# Altium project FMC_POF.PrjPcb
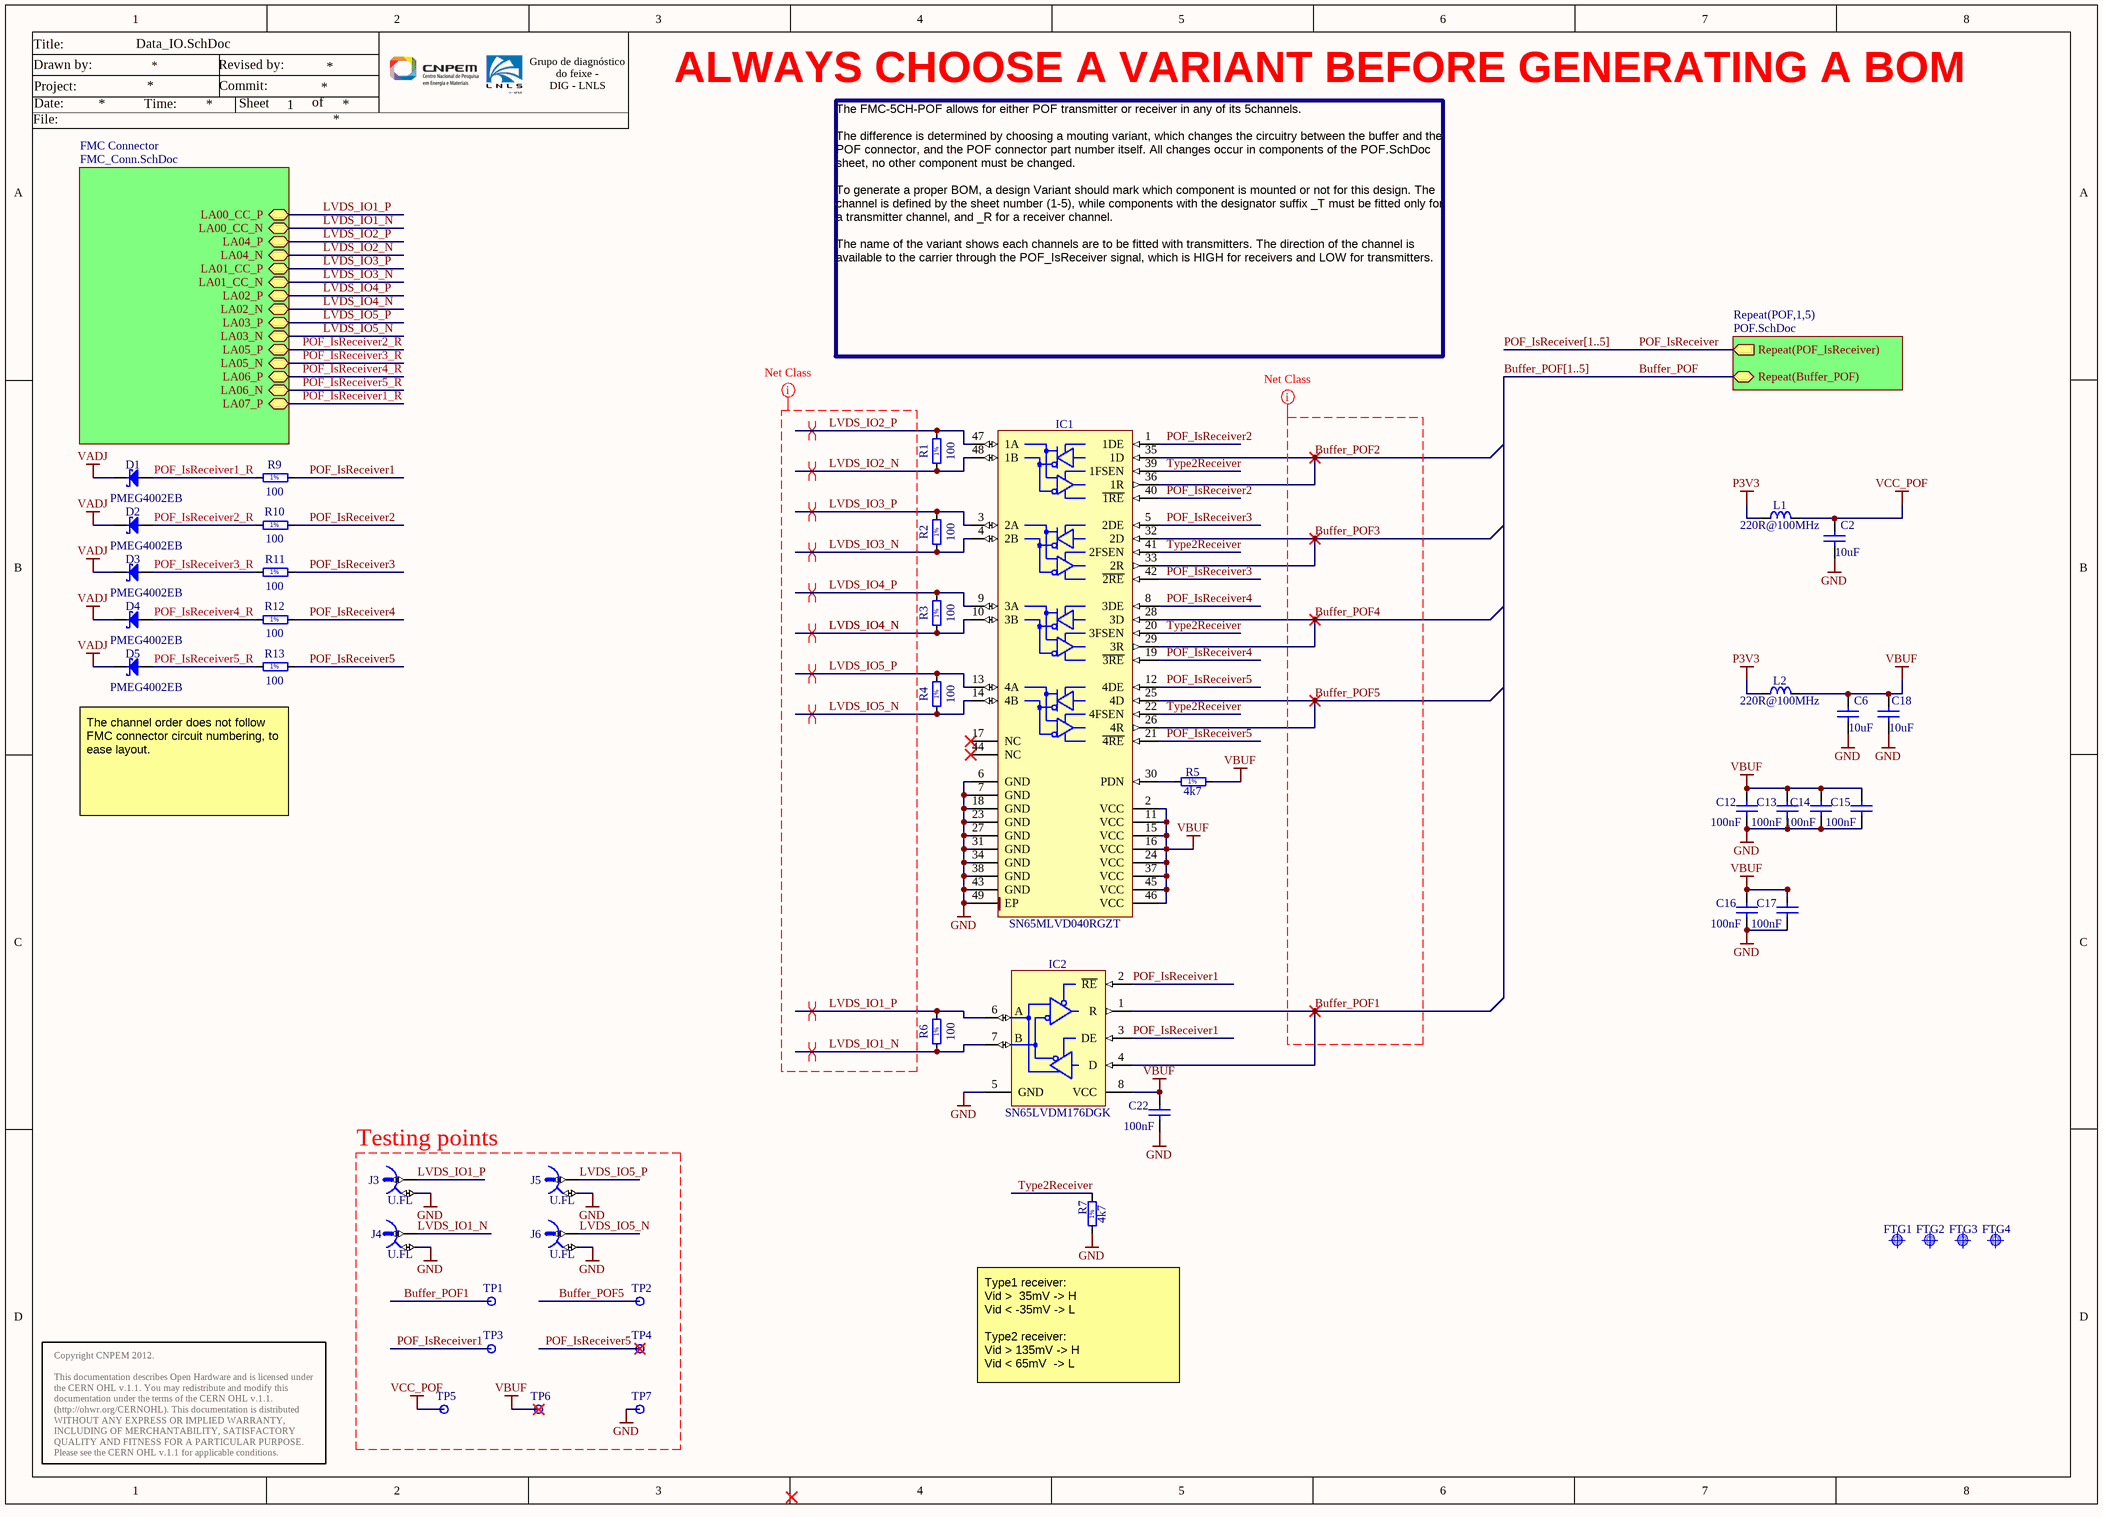
[diagram p0: Data_IO.SchDoc]
3 sheets, 115 parts. Net scope: hierarchical (ports join the sheet entries above them; power ports are global).
Board file: fmc-5pof.PcbDoc
Sheets:
  Data_IO.SchDoc
    POF1 = POF.SchDoc
    POF2 = POF.SchDoc
    POF3 = POF.SchDoc
    POF4 = POF.SchDoc
    POF5 = POF.SchDoc
    FMC Connector = FMC_Conn.SchDoc

## Sheet Data_IO.SchDoc
size A3; SheetNumber: 1

### Parts
C2  10uF  [CAPC2012X135N]
C6  10uF  [CAPC2012X135N]
C12  100nF  [CAPC1005X55N]
C13  100nF  [CAPC1005X55N]
C14  100nF  [CAPC1005X55N]
C15  100nF  [CAPC1005X55N]
C16  100nF  [CAPC1005X55N]
C17  100nF  [CAPC1005X55N]
C18  10uF  [CAPC2012X135N]
C22  100nF  [CAPC1005X55N]
D1  PMEG4002EB  [SODFL1608X65N]
D2  PMEG4002EB  [SODFL1608X65N]
D3  PMEG4002EB  [SODFL1608X65N]
D4  PMEG4002EB  [SODFL1608X65N]
D5  PMEG4002EB  [SODFL1608X65N]
FTG1  Use only in PCB  [FIDUCIAL_TOP_S100-200]  (value not drawn)
FTG2  Use only in PCB  [FIDUCIAL_TOP_S100-200]  (value not drawn)
FTG3  Use only in PCB  [FIDUCIAL_TOP_S100-200]  (value not drawn)
FTG4  Use only in PCB  [FIDUCIAL_TOP_S100-200]  (value not drawn)
IC1  SN65MLVD040RGZT  [QFN50P700X700X100-49N-S420]
IC2  SN65LVDM176DGK  [SOP65P490X110-8N]
J3  U.FL  [HIROSE_U.FL-R-SMT-1(10)]
J4  U.FL  [HIROSE_U.FL-R-SMT-1(10)]
J5  U.FL  [HIROSE_U.FL-R-SMT-1(10)]
J6  U.FL  [HIROSE_U.FL-R-SMT-1(10)]
L1  220R@100MHz  [INDC2012X105N]
L2  220R@100MHz  [INDC2012X105N]
R1  100  [RESC1005X40N]
R2  100  [RESC1005X40N]
R3  100  [RESC1005X40N]
R4  100  [RESC1005X40N]
R5  4k7  [RESC1005X40N]
R6  100  [RESC1005X40N]
R7  4k7  [RESC1005X40N]
R9  100  [RESC1005X40N]
R10  100  [RESC1005X40N]
R11  100  [RESC1005X40N]
R12  100  [RESC1005X40N]
R13  100  [RESC1005X40N]
TP1  Plated Hole  [c300h160]  (value not drawn)
TP2  Plated Hole  [c300h160]  (value not drawn)
TP3  Plated Hole  [c300h160]  (value not drawn)
TP4  Plated Hole  [c300h160]  (value not drawn)
TP5  Plated Hole  [c300h160]  (value not drawn)
TP6  Plated Hole  [c300h160]  (value not drawn)
TP7  Plated Hole  [c300h160]  (value not drawn)

### Sub-sheets
FMC Connector = FMC_Conn.SchDoc: LA00_CC_P, LA00_CC_N, LA04_N, LA04_P, LA01_CC_P, LA01_CC_N, LA02_N, LA02_P, LA03_N, LA03_P, LA06_P, LA06_N, LA07_P, LA05_P, LA05_N
Repeat(POF,1,5) = POF.SchDoc: Repeat(Buffer_POF) (bidir), Repeat(POF_IsReceiver) (out)

### Nets
GND: C2.1 C6.1 C12.1 C13.1 C14.1 C15.1 C16.1 C17.1 C18.1 C22.1 IC1.6(GND) IC1.7(GND) IC1.18(GND) IC1.23(GND) IC1.27(GND) IC1.31(GND) IC1.34(GND) IC1.38(GND) IC1.43(GND) IC1.49(EP) IC2.5(GND) J3.2 J4.2 J5.2 J6.2 R7.1 TP7.1
P3V3: L1.1 L2.1
VADJ: D1.1(C) D2.1(C) D3.1(C) D4.1(C) D5.1(C)
VBUF: C6.2 C12.2 C13.2 C14.2 C15.2 C16.2 C17.2 C18.2 C22.2 IC1.2(VCC) IC1.11(VCC) IC1.15(VCC) IC1.16(VCC) IC1.24(VCC) IC1.37(VCC) IC1.45(VCC) IC1.46(VCC) IC2.8(VCC) L2.2 R5.2 TP6.1
VCC_POF: C2.2 L1.2 TP5.1
Buffer_POF: sheet Repeat(POF,1,5)/Repeat(Buffer_POF)
Buffer_POF1: IC2.1(R) IC2.4(D) TP1.1  [project net Buffer_POF]
Buffer_POF2: IC1.35(1D) IC1.36(1R)  [project net Buffer_POF]
Buffer_POF3: IC1.32(2D) IC1.33(2R)  [project net Buffer_POF]
Buffer_POF4: IC1.28(3D) IC1.29(3R)  [project net Buffer_POF]
Buffer_POF5: IC1.25(4D) IC1.26(4R) TP2.1  [project net Buffer_POF]
LVDS_IO1_N: IC2.7(B) J4.1 R6.1 ; sheet FMC Connector/LA00_CC_N  [project net LA00_CC_N]
LVDS_IO1_P: IC2.6(A) J3.1 R6.2 ; sheet FMC Connector/LA00_CC_P  [project net LA00_CC_P]
LVDS_IO2_N: IC1.48(1B) R1.1 ; sheet FMC Connector/LA04_N  [project net LA04_N]
LVDS_IO2_P: IC1.47(1A) R1.2 ; sheet FMC Connector/LA04_P  [project net LA04_P]
LVDS_IO3_N: IC1.4(2B) R2.1 ; sheet FMC Connector/LA01_CC_N  [project net LA01_CC_N]
LVDS_IO3_P: IC1.3(2A) R2.2 ; sheet FMC Connector/LA01_CC_P  [project net LA01_CC_P]
LVDS_IO4_N: IC1.10(3B) R3.1 ; sheet FMC Connector/LA02_N  [project net LA02_N]
LVDS_IO4_P: IC1.9(3A) R3.2 ; sheet FMC Connector/LA02_P  [project net LA02_P]
LVDS_IO5_N: IC1.14(4B) J6.1 R4.1 ; sheet FMC Connector/LA03_N  [project net LA03_N]
LVDS_IO5_P: IC1.13(4A) J5.1 R4.2 ; sheet FMC Connector/LA03_P  [project net LA03_P]
POF_IsReceiver: sheet Repeat(POF,1,5)/Repeat(POF_IsReceiver)
POF_IsReceiver1: IC2.2(~{RE}) IC2.3(DE) R9.2 TP3.1  [project net AFBR_PIN3]
POF_IsReceiver1_R: D1.2(A) R9.1 ; sheet FMC Connector/LA07_P  [project net LA07_P]
POF_IsReceiver2: IC1.1(1DE) IC1.40(~{1RE}) R10.2  [project net AFBR_PIN3]
POF_IsReceiver2_R: D2.2(A) R10.1 ; sheet FMC Connector/LA05_P  [project net LA05_P]
POF_IsReceiver3: IC1.5(2DE) IC1.42(~{2RE}) R11.2  [project net AFBR_PIN3]
POF_IsReceiver3_R: D3.2(A) R11.1 ; sheet FMC Connector/LA05_N  [project net LA05_N]
POF_IsReceiver4: IC1.8(3DE) IC1.19(~{3RE}) R12.2  [project net AFBR_PIN3]
POF_IsReceiver4_R: D4.2(A) R12.1 ; sheet FMC Connector/LA06_P  [project net LA06_P]
POF_IsReceiver5: IC1.12(4DE) IC1.21(~{4RE}) R13.2 TP4.1  [project net AFBR_PIN3]
POF_IsReceiver5_R: D5.2(A) R13.1 ; sheet FMC Connector/LA06_N  [project net LA06_N]
Type2Receiver: IC1.20(3FSEN) IC1.22(4FSEN) IC1.39(1FSEN) IC1.41(2FSEN) R7.2
NetIC1_30: IC1.30(PDN) R5.1

Not connected (* = marked no-connect by the designer): IC1 17(NC)* 44(NC)*

### Buses and harness runs
bus Buffer_POF[1..5]
bus POF_IsReceiver[1..5]

### Layout directives
differential pair: LA00_CC_N, LA00_CC_P, LA01_CC_N, LA01_CC_P, LA02_N, LA02_P, LA03_N, LA03_P, LA04_N, LA04_P
Buffer_POF: BUFFER_POF: Buffer_POF1, Buffer_POF2, Buffer_POF3, Buffer_POF4, Buffer_POF5
net class LVDS_IO: LVDS_IO1_N, LVDS_IO1_P, LVDS_IO2_N, LVDS_IO2_P, LVDS_IO3_N, LVDS_IO3_P, LVDS_IO4_N, LVDS_IO4_P, LVDS_IO5_N, LVDS_IO5_P

### Notes on the sheet
- ALWAYS CHOOSE A VARIANT BEFORE GENERATING A BOM
- The FMC-5CH-POF allows for either POF transmitter or receiver in any of its 5channels.
  The difference is determined by choosing a mouting variant, which changes the circuitry between the buffer and the POF connector, and the POF connector part number itself. All changes occur in components of the POF.SchDoc sheet, no other component must be changed.
  To generate a proper BOM, a design Variant should mark which component is mounted or not for this design. The channel is defined by the sheet number (1-5), while components with the designator suffix _T must be fitted only for a transmitter channel, and _R for a receiver channel.
  The name of the variant shows each channels are to be fitted with transmitters. The direction of the channel is available to the carrier through the POF_IsReceiver signal, which is HIGH for receivers and LOW for transmitters.
- The channel order does not follow FMC connector circuit numbering, to ease layout.
- Testing points
- (near R7) Type1 receiver:
  Vid >  35mV -> H
  Vid < -35mV -> L
  Type2 receiver:
  Vid > 135mV -> H
  Vid < 65mV  -> L
- Title:
- Date:
- Project:
- Drawn by:
- Time:
- Commit:
- Revised by:
- Sheet
- of
- Grupo de diagnóstico do feixe -
  DIG - LNLS
- File:
- Copyright CNPEM 2012.
  This documentation describes Open Hardware and is licensed under the CERN OHL v.1.1. You may redistribute and modify this documentation under the terms of the CERN OHL v.1.1. (http://ohwr.org/CERNOHL). This documentation is distributed WITHOUT ANY EXPRESS OR IMPLIED WARRANTY, INCLUDING OF MERCHANTABILITY, SATISFACTORY QUALITY AND FITNESS FOR A PARTICULAR PURPOSE. Please see the CERN OHL v.1.1 for applicable conditions.
- (in symbol R0402_4K7_1%_0.0625W_100PPM) 1%
- (in symbol R0402_100R_1%_0.0625W_100PPM) 1%

### Library data of the parts
C2 C6 C18 = CC0805_10UF_10V_10%_X7R: Non-polarised capacitor; Part Description: SMD Multilayer Chip Ceramic Capacitor; Manufacturer: GENERIC; Manufacturer1 Part Number: GRM21BR71A106KE51L; Voltage: 10V; TC: X7R; Tolerance: ±10%; Part Number: CC0805_10UF_10V_10%_X7R; Component Kind: Standard; Component Type: Standard; Pin Count: 2; Value: 10uF; Status: Preferred; Manufacturer Part Number: CC0805_10UF_10V_10%_X7R; Case: 0805; Mounted: Yes; Socket: No; SMD: Yes; Sense: No; Manufacturer1 Example: MURATA; Manufacturer1 ComponentHeight: 1.35mm; HelpURL: \\cern.ch\dfs\Applications\Altium\Datasheets\CC0805_X7R_MURATA.pdf; Author: CERN DEM JLC; CreateDate: 30/04/2012; LatestRevisionDate: 30/04/2012
C12-C17 C22 = CC0402_100NF_16V_10%_X5R: Non-polarised capacitor; Part Description: SMD Multilayer Chip Ceramic Capacitor; Manufacturer: GENERIC; Manufacturer1 Part Number: GRM155R61C104KA88D; Voltage: 16V; TC: X5R; Tolerance: ±10%; Part Number: CC0402_100NF_16V_10%_X5R; Component Kind: Standard; Component Type: Standard; Pin Count: 2; Value: 100nF; Status: None; Manufacturer Part Number: CC0402_100NF_16V_10%_X5R; Case: 0402; Mounted: Yes; Socket: No; SMD: Yes; Sense: No; Manufacturer1 Example: MURATA; Manufacturer1 ComponentHeight: 0.55mm; HelpURL: \\cern.ch\dfs\Applications\Altium\Datasheets\CC0402_X5R_MURATA_GRM.pdf; Author: CERN DEM JLC; CreateDate: 10/12/2013; LatestRevisionDate: 10/12/2013
D1-D5 = PMEG4002EB: Schottky Diode; Part Description: Very Low VF MEGA Schottky Barrier Rectifier; Manufacturer: NXP SEMICONDUCTORS; Voltage: 40V; Power: 200mA; Bonding: No; PressFit: No; Part Number: PMEG4002EB; Component Kind: Standard; Component Type: Standard; Device: PMEG4002EB; PackageDescription: Ultra Small Outline Diode Flat Lead (SOD-523), Body; 1.2mm L X 0.8mm W X 0.65mm H, IPC Medium Density; Manufacturer Part Number: PMEG4002EB; Pin Count: 2; Case: SOD523; Mounted: Yes; Socket: No; SMD: Yes; ComponentHeight: 0.65mm; HelpURL: \\cern.ch\dfs\Applications\Altium\Datasheets\PMEG4002EB.pdf; Author: CERN DEM JMW; CreateDate: 21/04/2009; LatestRevisionDate: 07/05/2009; Sense: No
FTG1-FTG4 = FIDUCIAL_TARGET_S100-200: Fiducial Target; Part Description: Square Fiducial Target, Top Layer, 1.0mm, Top Solder 2.0mm, Keepout =2.0mm; Mounted: No; Part Number: FIDUCIAL_TARGET_S100-200; Component Kind: Standard (No BOM); Component Type: Standard (No BOM); Pin Count: 1; Family: Fiducial; Socket: No; SMD: Yes; Sense: No; Status: None; ComponentHeight: 0mm; HelpURL: Undefined; Author: CERN DEM JLC; CreateDate: 09/02/2010; LatestRevisionDate: 04/04/2012; PackageDescription: Square Fiducial Target, Top Layer, 1.0mm, Top Solder 2.0mm, Keepout =2.0mm
IC1 = SN65MLVD040RGZT: 4-Channel Half-Duplex M-LVDS Line Transceiver; Manufacturer: TEXAS INSTRUMENTS; PressFit: No; Bonding: No; Part Number: SN65MLVD040RGZT; Component Kind: Standard; Component Type: Standard; Device: SN65MLVD040RGZT; PackageDescription: QFN, 0.50mm Pitch, Square; 48 Pin, 7.00mm L X 7.00mm W X 1mm H body (W/Thermal Tab 4.2mm X 4.2mm), IPC Medium Density; Part Description: 4-Channel Half-Duplex M-LVDS Line Transceiver; Manufacturer Part Number: SN65MLVD040RGZT; Pin Count: 49; Case: QFN48; Mounted: Yes; Socket: No; SMD: Yes; Sense: No; ComponentHeight: 1mm; Author: CERN DEM JLC; HelpURL: \\cern.ch\dfs\Applications\Altium\Datasheets\SN65MLVD040RGZT.pdf; CreateDate: 17/03/2011; LatestRevisionDate: 17/03/2011
IC2 = SN65LVDM176DGK: Half-Duplex LVDM Transceiver; Part Description: High-Speed, Half-Duplex LVDM Transceiver; Manufacturer: TEXAS INSTRUMENTS; PressFit: No; Bonding: No; Part Number: SN65LVDM176DGK; Component Kind: Standard; Component Type: Standard; Device: SN65LVDM176DGK; PackageDescription: SOP, 0.65mm, Pitch; 8 Pin, 3.0mm W X 3.0mm L X 1.10mm H Body, IPC Medium Density; Manufacturer Part Number: SN65LVDM176DGK; Pin Count: 8; Case: SSOP8; Mounted: Yes; Socket: No; SMD: Yes; Sense: No; ComponentHeight: 1.1mm; Author: CERN DEM JLC; HelpURL: \\cern.ch\dfs\Applications\Altium\Datasheets\SN65LVDM176DGK.pdf; CreateDate: 18/07/2014; LatestRevisionDate: 18/07/2014
J3-J6 = HIROSE_U.FL-R-SMT-1(10): Part Description: Up to 6GHz Ultra Small Surface Mount Male Coaxial Connectors U.FL Series; Manufacturer: HIROSE (HRS); PressFit: No; Part Number: HIROSE_U.FL-R-SMT-1(10); Component Kind: Standard; Component Type: Standard; Pin Count: 2; Family: U.FL; Mounted: Yes; Socket: No; SMD: Yes; Sense: No; Status: None; Manufacturer Part Number: U.FL-R-SMT-1(10); ComponentHeight: 1.25mm; HelpURL: \\cern.ch\dfs\Applications\Altium\Datasheets\HIROSE_U.FL-R-SMT-1(10).pdf; Author: CERN DEM JLC; CreateDate: 24/03/2010; LatestRevisionDate: 24/03/2010
L1 L2 = IND0805_MURATA_BLM21PG221SN1D: Inductor; Part Description: SMD EMIFIL Suppression Chip Ferrite Bead; Manufacturer: MURATA; Power: 2A; Resistance: 0.05R; Tolerance: ±25%; Part Number: IND0805_MURATA_BLM21PG221SN1D; Component Kind: Standard; Component Type: Standard; Pin Count: 2; Value: 220R@100MHz; Status: None; Manufacturer Part Number: BLM21PG221SN1D; Case: 0805; Mounted: Yes; Socket: No; SMD: Yes; ComponentHeight: 1.05mm; HelpURL: \\cern.ch\dfs\Applications\Altium\Datasheets\IND0402_MURATA_BLM21P.pdf; Author: CERN DEM JLC; CreateDate: 25/01/2010; LatestRevisionDate: 25/01/2010; Sense: No
R1-R4 R6 R9-R13 = R0402_100R_1%_0.0625W_100PPM: Resistor - 1%; Part Description: General Purpose Thick Film Chip Resistor; Manufacturer: GENERIC; Manufacturer1 Part Number: 232270671001L; TC: ±100ppm/°C; Part Number: R0402_100R_1%_0.0625W_100PPM; Component Kind: Standard; Component Type: Standard; Pin Count: 2; Value: 100; Status: Not recommended; Power: 0.0625W; Tolerance: ±1%; Manufacturer Part Number: R0402_100R_1%_0.0625W_100PPM; Case: 0402; Mounted: Yes; Sense: No; Socket: No; SMD: Yes; Manufacturer1 Example: YAGEO PHYCOMP; Manufacturer1 ComponentHeight: 0.4mm; HelpURL: \\cern.ch\dfs\Applications\Altium\Datasheets\R0402_Phycomp_RC0402.pdf; Author: CERN DEM JLC; CreateDate: 03/12/2007; LatestRevisionDate: 17/10/2012
R5 R7 = R0402_4K7_1%_0.0625W_100PPM: Resistor - 1%; Part Description: General Purpose Thick Film Chip Resistor; Manufacturer: GENERIC; Manufacturer1 Part Number: 232270674702L; TC: ±100ppm/°C; Part Number: R0402_4K7_1%_0.0625W_100PPM; Component Kind: Standard; Component Type: Standard; Pin Count: 2; Value: 4k7; Status: Not recommended; Power: 0.0625W; Tolerance: ±1%; Manufacturer Part Number: R0402_4K7_1%_0.0625W_100PPM; Case: 0402; Mounted: Yes; Sense: No; Socket: No; SMD: Yes; Manufacturer1 Example: YAGEO PHYCOMP; Manufacturer1 ComponentHeight: 0.4mm; HelpURL: \\cern.ch\dfs\Applications\Altium\Datasheets\R0402_Phycomp_RC0402.pdf; Author: CERN DEM JLC; CreateDate: 03/12/2007; LatestRevisionDate: 17/10/2012
TP1-TP7 = PLATED_HOLE1.6_PAD3.0: Single Terminal Socket; Part Description: Plated Through Hole: Hole Dia.=1.6mm Pad Dia.=3.0mm; Mounted: No; Part Number: PLATED_HOLE1.6_PAD3.0; Component Kind: Standard (No BOM); Component Type: Standard (No BOM); Pin Count: 1; Family: Plated Hole; Socket: No; SMD: No; Sense: No; Status: None; ComponentHeight: 0mm; HelpURL: Undefined; Author: CERN DEM JMW; CreateDate: 05/11/2009; LatestRevisionDate: 05/11/2009; PackageDescription: Plated Through Hole: Hole Dia.=1.6mm Pad Dia.=3.0mm

## Sheet POF.SchDoc
size A3; SheetNumber: 2
Used 5 times, as channels POF1, POF2, POF3, POF4, POF5. Parts and nets are listed once, with the designators drawn on the sheet.
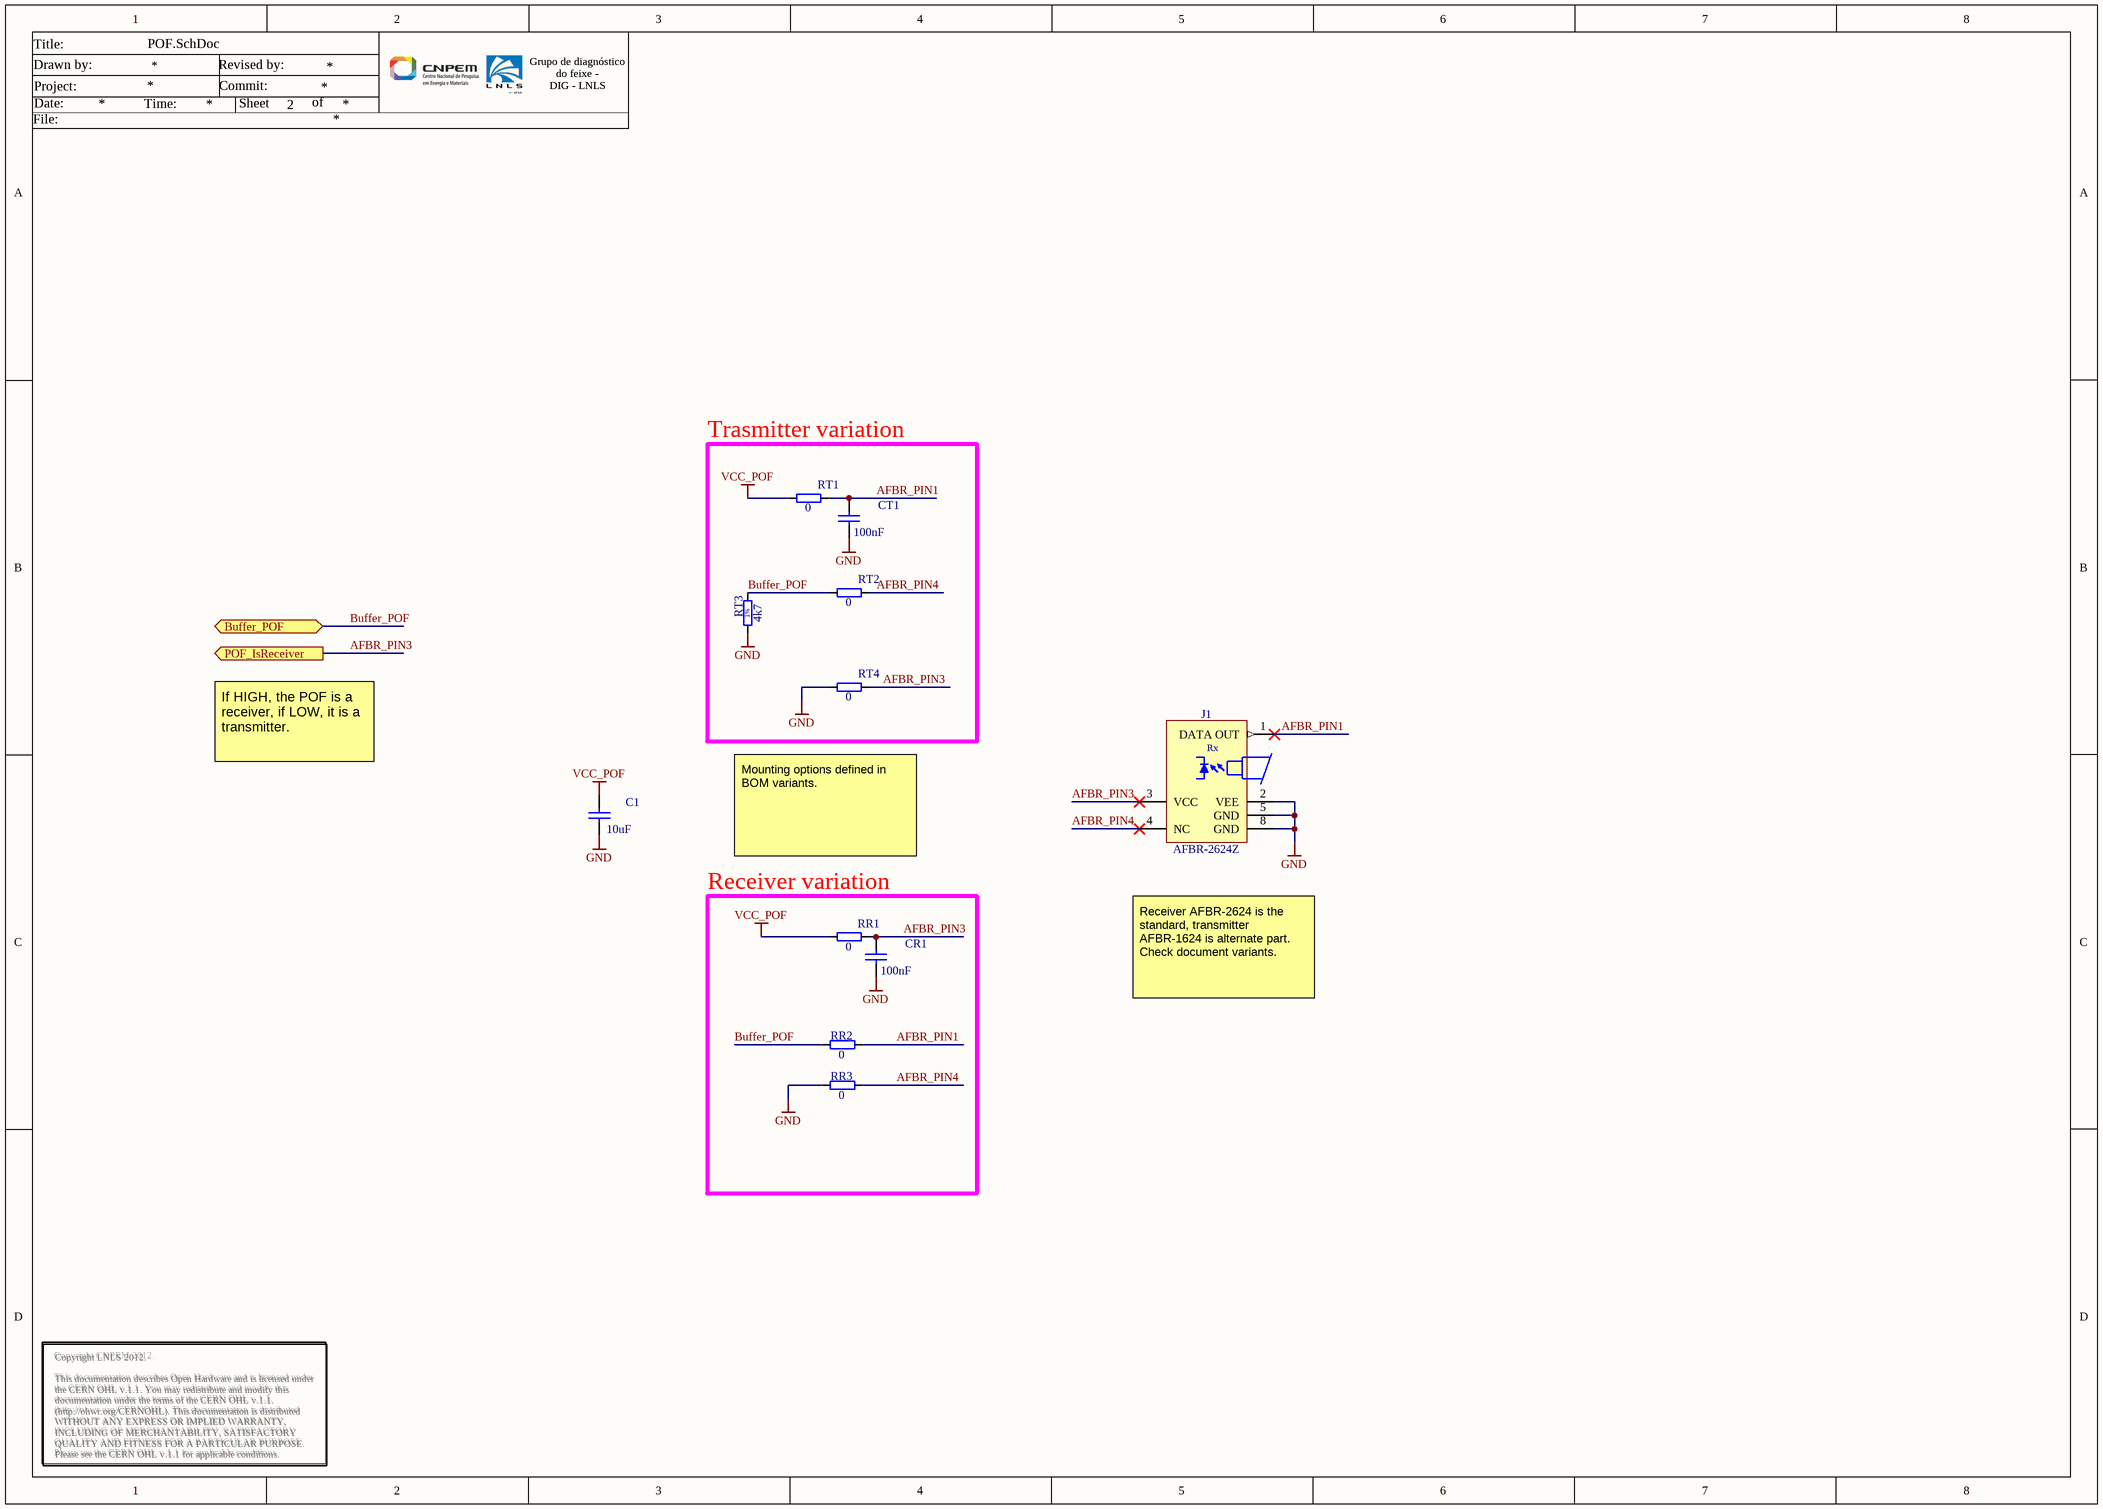
[diagram p1: POF.SchDoc]

### Parts
C1  10uF  [CAPC2012X135N]
CR1  100nF  [CAPC1005X55N]
CT1  100nF  [CAPC1005X55N]
J1  AFBR-2624Z  [AFBR-x624Z]
RR1  0  [RESC1005X40N]
RR2  0  [RESC1005X40N]
RR3  0  [RESC1005X40N]
RT1  0  [RESC1005X40N]
RT2  0  [RESC1005X40N]
RT3  4k7  [RESC1005X40N]
RT4  0  [RESC1005X40N]

### Blocks framed on the sheet
Trasmitter variation: CT1 RT1-RT4
Receiver variation: CR1 RR1-RR3

### Ports
Buffer_POF (bidir), POF_IsReceiver (out)

### Nets
GND: C1.1 CR1.1 CT1.1 J1.2(VEE) J1.5(GND) J1.8(GND) RR3.1 RT3.1 RT4.1
VCC_POF: C1.2 RR1.1 RT1.1
AFBR_PIN1: CT1.2 J1.1(DATA_OUT) RR2.2 RT1.2
AFBR_PIN3: CR1.2 J1.3(VCC) RR1.2 RT4.2 ; port POF_IsReceiver
AFBR_PIN4: J1.4(NC) RR3.2 RT2.2
Buffer_POF: RR2.1 RT2.1 RT3.2 ; port Buffer_POF

### Channels
POF1: designators end in _1; ports Buffer_POF=Buffer_POF POF_IsReceiver=AFBR_PIN3
POF2: designators end in _2; ports Buffer_POF=Buffer_POF POF_IsReceiver=AFBR_PIN3
POF3: designators end in _3; ports Buffer_POF=Buffer_POF POF_IsReceiver=AFBR_PIN3
POF4: designators end in _4; ports Buffer_POF=Buffer_POF POF_IsReceiver=AFBR_PIN3
POF5: designators end in _5; ports Buffer_POF=Buffer_POF POF_IsReceiver=AFBR_PIN3

### Notes on the sheet
- Title:
- Date:
- Project:
- Drawn by:
- Time:
- Commit:
- Revised by:
- Sheet
- of
- Grupo de diagnóstico do feixe -
  DIG - LNLS
- File:
- If HIGH, the POF is a receiver, if LOW, it is a transmitter.
- Mounting options defined in BOM variants.
- Receiver AFBR-2624 is the standard, transmitter AFBR-1624 is alternate part. Check document variants.
- Copyright LNLS 2012.
  This documentation describes Open Hardware and is licensed under the CERN OHL v.1.1. You may redistribute and modify this documentation under the terms of the CERN OHL v.1.1. (http://ohwr.org/CERNOHL). This documentation is distributed WITHOUT ANY EXPRESS OR IMPLIED WARRANTY, INCLUDING OF MERCHANTABILITY, SATISFACTORY QUALITY AND FITNESS FOR A PARTICULAR PURPOSE. Please see the CERN OHL v.1.1 for applicable conditions.
- Copyright CNPEM 2012.
  This documentation describes Open Hardware and is licensed under the CERN OHL v.1.1. You may redistribute and modify this documentation under the terms of the CERN OHL v.1.1. (http://ohwr.org/CERNOHL). This documentation is distributed WITHOUT ANY EXPRESS OR IMPLIED WARRANTY, INCLUDING OF MERCHANTABILITY, SATISFACTORY QUALITY AND FITNESS FOR A PARTICULAR PURPOSE. Please see the CERN OHL v.1.1 for applicable conditions.
- (in symbol AFBR-2624Z) Rx
- (in symbol R0402_4K7_1%_0.0625W_100PPM) 1%

### Library data of the parts
C1 = CC0805_10UF_10V_10%_X7R: as C2 on sheet Data_IO; Part Number: CC0805_10UF_10V_10%_X7R; Component Kind: Standard; Component Type: Standard; Pin Count: 2; Value: 10uF; Status: Preferred; Manufacturer Part Number: CC0805_10UF_10V_10%_X7R; Case: 0805; Mounted: Yes; Socket: No; SMD: Yes; Sense: No; Manufacturer1 Example: MURATA; Manufacturer1 ComponentHeight: 1.35mm; HelpURL: \\cern.ch\dfs\Applications\Altium\Datasheets\CC0805_X7R_MURATA.pdf; Author: CERN DEM JLC; CreateDate: 30/04/2012; LatestRevisionDate: 30/04/2012
CR1 CT1 = CC0402_100NF_16V_10%_X5R: as C12 on sheet Data_IO; Part Number: CC0402_100NF_16V_10%_X5R; Component Kind: Standard; Component Type: Standard; Pin Count: 2; Value: 100nF; Status: None; Manufacturer Part Number: CC0402_100NF_16V_10%_X5R; Case: 0402; Mounted: Yes; Socket: No; SMD: Yes; Sense: No; Manufacturer1 Example: MURATA; Manufacturer1 ComponentHeight: 0.55mm; HelpURL: \\cern.ch\dfs\Applications\Altium\Datasheets\CC0402_X5R_MURATA_GRM.pdf; Author: CERN DEM JLC; CreateDate: 10/12/2013; LatestRevisionDate: 10/12/2013
J1 = AFBR-2624Z: DC-50MBd Versatile Link Fiber Optic Receiver for 1 mm POF and 200 µm PCS; Manufacturer: AVAGO TECHNOLOGIES; PressFit: No; Part Number: AFBR-2624Z; Component Kind: Standard; Component Type: Standard; Device: AFBR-2624Z; Pin Count: 6; Family: Optical Fiber; Mounted: Yes; Socket: No; SMD: No; Sense: No; Status: None; Part Description: DC-50MBd Versatile Link Fiber Optic Receiver for 1 mm POF and 200 µm PCS; Manufacturer Part Number: AFBR-2624Z; ComponentHeight: 7.62mm; HelpURL: \\cern.ch\dfs\Applications\Altium\Datasheets\AFBR-2624Z.pdf; Author: CERN DEM MR; CreateDate: 18/05/2016; LatestRevisionDate: 18/05/2016
RR1-RR3 RT1 RT2 RT4 = R0402_0R_JUMPER: Resistor; Part Description: 1A (0.05R Max DC Resistance) Zero Ohm Jumper; Manufacturer: GENERIC; Manufacturer1 Part Number: 232270591001L; Part Number: R0402_0R_JUMPER; Component Kind: Standard; Component Type: Standard; Pin Count: 2; Value: 0; Status: Not recommended; Manufacturer Part Number: R0402_0R_JUMPER; Case: 0402; Mounted: Yes; Sense: No; Socket: No; SMD: Yes; Manufacturer1 Example: YAGEO PHYCOMP; Manufacturer1 ComponentHeight: 0.4mm; HelpURL: \\cern.ch\dfs\Applications\Altium\Datasheets\R0402_Phycomp_RC0402.pdf; Author: CERN DEM JLC; CreateDate: 03/12/2007; LatestRevisionDate: 17/10/2012
RT3 = R0402_4K7_1%_0.0625W_100PPM: as R5 on sheet Data_IO; Part Number: R0402_4K7_1%_0.0625W_100PPM; Component Kind: Standard; Component Type: Standard; Pin Count: 2; Value: 4k7; Status: Not recommended; Power: 0.0625W; Tolerance: ±1%; Manufacturer Part Number: R0402_4K7_1%_0.0625W_100PPM; Case: 0402; Mounted: Yes; Sense: No; Socket: No; SMD: Yes; Manufacturer1 Example: YAGEO PHYCOMP; Manufacturer1 ComponentHeight: 0.4mm; HelpURL: \\cern.ch\dfs\Applications\Altium\Datasheets\R0402_Phycomp_RC0402.pdf; Author: CERN DEM JLC; CreateDate: 03/12/2007; LatestRevisionDate: 17/10/2012

## Sheet FMC_Conn.SchDoc
size A3; SheetNumber: 3; ProjectName: FMC-5CH-POF
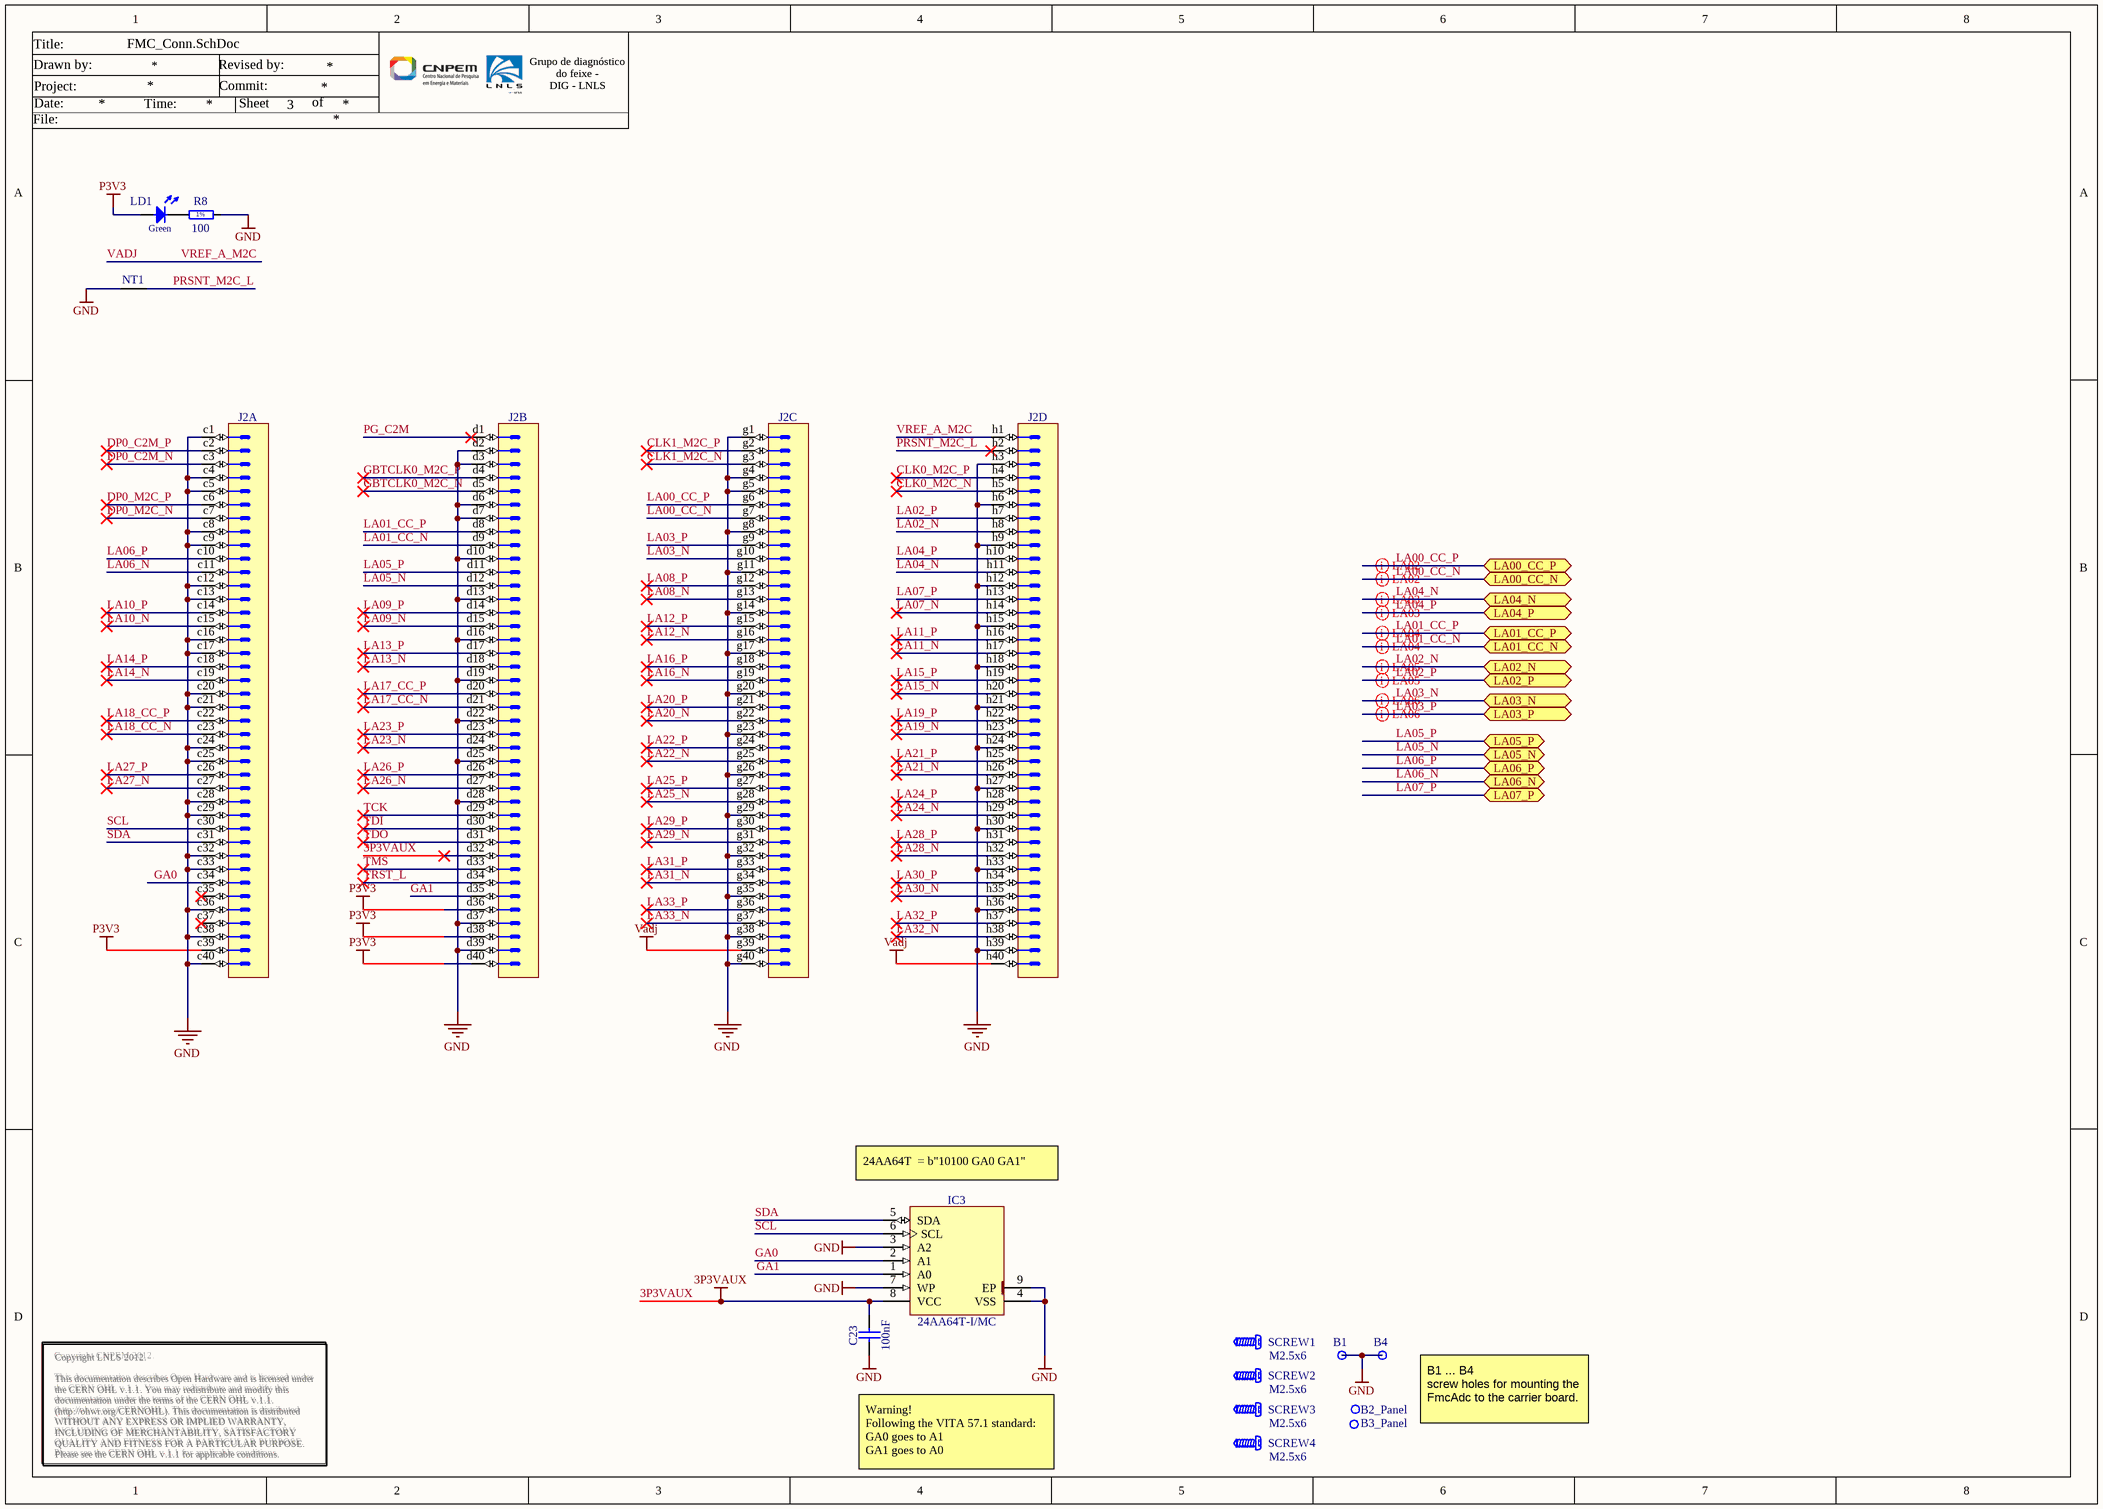
[diagram p2: FMC_Conn.SchDoc]

### Parts
B1  Plated Hole  [MTG270_500_M]  (value not drawn)
B2_Panel  Plated Hole  [MTG270_500_M]  (value not drawn)
B3_Panel  Plated Hole  [MTG270_500_M]  (value not drawn)
B4  Plated Hole  [MTG270_500_M]  (value not drawn)
C23  100nF  [CAPC1005X55N]
IC3  24AA64T-I/MC  [SON50P300X200X100-9N-R175X155]
J2  VITA 57  [SAMTEC_ASP-134606-01]  (value not drawn)  (parts A,B,C,D of 4)
LD1  Green  [LED_OSRAM_LGL29K]  (value not drawn)
NT1  Net Tie  [Net Tie]  (value not drawn)  (net tie, no BOM)
R8  100  [RESC1005X40N]
SCREW1  M2.5x6  [BOSSARD_BN5687-3061597_v]
SCREW2  M2.5x6  [BOSSARD_BN5687-3061597_v]
SCREW3  M2.5x6  [BOSSARD_BN5687-3061597_v]
SCREW4  M2.5x6  [BOSSARD_BN5687-3061597_v]

### Ports
LA00_CC_N, LA00_CC_P, LA01_CC_N, LA01_CC_P, LA02_N, LA02_P, LA03_N, LA03_P, LA04_N, LA04_P, LA05_N, LA05_P, LA06_N, LA06_P, LA07_P

### Nets
3P3VAUX: C23.2 IC3.8(VCC) J2.d32
GND: B1.1 B4.1 C23.1 IC3.3(A2) IC3.4(VSS) IC3.7(WP) IC3.9(EP) J2.c1 J2.c4 J2.c5 J2.c8 J2.c9 J2.c12 J2.c13 J2.c16 J2.c17 J2.c20 J2.c21 J2.c24 J2.c25 J2.c28 J2.c29 J2.c32 J2.c33 J2.c36 J2.c38 J2.c40 J2.d2 J2.d3 J2.d6 J2.d7 J2.d10 J2.d13 J2.d16 J2.d19 J2.d22 J2.d25 J2.d28 J2.d37 J2.d39 J2.g1 J2.g4 J2.g5 J2.g8 J2.g11 J2.g14 J2.g17 J2.g20 J2.g23 J2.g26 J2.g29 J2.g32 J2.g35 J2.g38 J2.g40 J2.h3 J2.h6 J2.h9 J2.h12 J2.h15 J2.h18 J2.h21 J2.h24 J2.h27 J2.h30 J2.h33 J2.h36 J2.h39 NT1.1 R8.2
P3V3: J2.c39 J2.d36 J2.d38 J2.d40 LD1.2(A)
VADJ: J2.g39 J2.h1 J2.h40  [also labelled VREF_A_M2C]
CLK0_M2C_N: J2.h5
CLK0_M2C_P: J2.h4
CLK1_M2C_N: J2.g3
CLK1_M2C_P: J2.g2
DP0_C2M_N: J2.c3
DP0_C2M_P: J2.c2
DP0_M2C_N: J2.c7
DP0_M2C_P: J2.c6
GA0: IC3.2(A1) J2.c34
GA1: IC3.1(A0) J2.d35
GBTCLK0_M2C_N: J2.d5
GBTCLK0_M2C_P: J2.d4
LA00_CC_N: J2.g7 ; port LA00_CC_N
LA00_CC_P: J2.g6 ; port LA00_CC_P
LA01_CC_N: J2.d9 ; port LA01_CC_N
LA01_CC_P: J2.d8 ; port LA01_CC_P
LA02_N: J2.h8 ; port LA02_N
LA02_P: J2.h7 ; port LA02_P
LA03_N: J2.g10 ; port LA03_N
LA03_P: J2.g9 ; port LA03_P
LA04_N: J2.h11 ; port LA04_N
LA04_P: J2.h10 ; port LA04_P
LA05_N: J2.d12 ; port LA05_N
LA05_P: J2.d11 ; port LA05_P
LA06_N: J2.c11 ; port LA06_N
LA06_P: J2.c10 ; port LA06_P
LA07_N: J2.h14
LA07_P: J2.h13 ; port LA07_P
LA08_N: J2.g13
LA08_P: J2.g12
LA09_N: J2.d15
LA09_P: J2.d14
LA10_N: J2.c15
LA10_P: J2.c14
LA11_N: J2.h17
LA11_P: J2.h16
LA12_N: J2.g16
LA12_P: J2.g15
LA13_N: J2.d18
LA13_P: J2.d17
LA14_N: J2.c19
LA14_P: J2.c18
LA15_N: J2.h20
LA15_P: J2.h19
LA16_N: J2.g19
LA16_P: J2.g18
LA17_CC_N: J2.d21
LA17_CC_P: J2.d20
LA18_CC_N: J2.c23
LA18_CC_P: J2.c22
LA19_N: J2.h23
LA19_P: J2.h22
LA20_N: J2.g22
LA20_P: J2.g21
LA21_N: J2.h26
LA21_P: J2.h25
LA22_N: J2.g25
LA22_P: J2.g24
LA23_N: J2.d24
LA23_P: J2.d23
LA24_N: J2.h29
LA24_P: J2.h28
LA25_N: J2.g28
LA25_P: J2.g27
LA26_N: J2.d27
LA26_P: J2.d26
LA27_N: J2.c27
LA27_P: J2.c26
LA28_N: J2.h32
LA28_P: J2.h31
LA29_N: J2.g31
LA29_P: J2.g30
LA30_N: J2.h35
LA30_P: J2.h34
LA31_N: J2.g34
LA31_P: J2.g33
LA32_N: J2.h38
LA32_P: J2.h37
LA33_N: J2.g37
LA33_P: J2.g36
PG_C2M: J2.d1
PRSNT_M2C_L: J2.h2 NT1.2
SCL: IC3.6(SCL) J2.c30
SDA: IC3.5(SDA) J2.c31
TCK: J2.d29
TDI: J2.d30
TDO: J2.d31
TMS: J2.d33
TRST_L: J2.d34
NetLD1_1: LD1.1(C) R8.1

Not connected (* = marked no-connect by the designer): B2_Panel 1; B3_Panel 1; J2 c35* c37*

### Layout directives
differential pair: LA00_CC_N, LA00_CC_P, LA01_CC_N, LA01_CC_P, LA02_N, LA02_P, LA03_N, LA03_P, LA04_N, LA04_P

### Notes on the sheet
- Title:
- Date:
- Project:
- Drawn by:
- Time:
- Commit:
- Revised by:
- Sheet
- of
- Grupo de diagnóstico do feixe -
  DIG - LNLS
- File:
- (near IC3) 24AA64T  = b"10100 GA0 GA1"
- Copyright LNLS 2012.
  This documentation describes Open Hardware and is licensed under the CERN OHL v.1.1. You may redistribute and modify this documentation under the terms of the CERN OHL v.1.1. (http://ohwr.org/CERNOHL). This documentation is distributed WITHOUT ANY EXPRESS OR IMPLIED WARRANTY, INCLUDING OF MERCHANTABILITY, SATISFACTORY QUALITY AND FITNESS FOR A PARTICULAR PURPOSE. Please see the CERN OHL v.1.1 for applicable conditions.
- (near C23) Warning!
  Following the VITA 57.1 standard:
  GA0 goes to A1
  GA1 goes to A0
- (near B4) B1 ... B4
  screw holes for mounting the FmcAdc to the carrier board.
- Copyright CNPEM 2012.
  This documentation describes Open Hardware and is licensed under the CERN OHL v.1.1. You may redistribute and modify this documentation under the terms of the CERN OHL v.1.1. (http://ohwr.org/CERNOHL). This documentation is distributed WITHOUT ANY EXPRESS OR IMPLIED WARRANTY, INCLUDING OF MERCHANTABILITY, SATISFACTORY QUALITY AND FITNESS FOR A PARTICULAR PURPOSE. Please see the CERN OHL v.1.1 for applicable conditions.
- (in symbol R0402_100R_1%_0.0625W_100PPM) 1%

### Library data of the parts
B1 B2_Panel B3_Panel B4 = PLATED_HOLE2.7_PAD5.0_M: Single Terminal Socket; Part Description: Plated Through Hole: Hole Dia.=2.7mm Pad Dia.=5.0mm Middle hole 3mm; Mounted: No; Part Number: PLATED_HOLE2.7_PAD5.0_M; Component Kind: Standard (No BOM); Component Type: Standard (No BOM); Pin Count: 1; Family: Plated Hole; Socket: No; SMD: No; Status: None; ComponentHeight: 0mm; Author: LNLS DIG FCS; CreateDate: 06/06/2016; LatestRevisionDate: 06/06/2016; PackageDescription: Plated Through Hole: Hole Dia.=2.7mm Pad Dia.=5.0mm Middle hole 3mm; Sense: No; HelpURL: Undefined
C23 = CC0402_100NF_16V_10%_X5R: as C12 on sheet Data_IO; Part Number: CC0402_100NF_16V_10%_X5R; Component Kind: Standard; Component Type: Standard; Pin Count: 2; Value: 100nF; Status: None; Manufacturer Part Number: CC0402_100NF_16V_10%_X5R; Case: 0402; Mounted: Yes; Socket: No; SMD: Yes; Manufacturer1 Example: MURATA; Manufacturer1 ComponentHeight: 0.55mm; HelpURL: \\cern.ch\dfs\Applications\Altium\Datasheets\CC0402_X5R_MURATA_GRM.pdf; Author: CERN DEM JLC; CreateDate: 10/12/2013; LatestRevisionDate: 10/12/2013; Sense: No
IC3 = 24AA64T-I/MC: 1.7-5.5V 64K I2C Serial EEPROM; Part Description: 1.7V-5.5V, 64K  (8K x 8-bit) I2C Serial EEPROM; Manufacturer: MICROCHIP TECHNOLOGY; Bonding: No; PressFit: No; Part Number: 24AA64T-I/MC; Component Kind: Standard; Component Type: Standard; Device: 24AA64T-I/MC; PackageDescription: SON (DFN), 0.50mm pitch, 8 pin, 2mm X 3mm X 1.00mm H body (w/thermal tab 1.75 X 1.55mm),  IPC Medium Density; Manufacturer Part Number: 24AA64T-I/MC; Pin Count: 9; Case: DFN8; Mounted: Yes; Socket: No; SMD: Yes; ComponentHeight: 1mm; HelpURL: \\cern.ch\dfs\Applications\Altium\Datasheets\24AA64T-I-MC.pdf; Author: CERN DEM JLC; CreateDate: 18/11/2009; LatestRevisionDate: 24/01/2011; Sense: No
J2 = SAMTEC_ASP-134606-01: Connector VITA 57, 160 Male contacts in 4 row cdgh; Part Description: 160 contacts (4 rows cdgh) Surface Mount Male Connector, VITA 57 (MC-LPC-10); Manufacturer: SAMTEC; PressFit: No; Part Number: SAMTEC_ASP-134606-01; Component Kind: Standard; Component Type: Standard; Pin Count: 160; Family: VITA 57; Mounted: Yes; Socket: No; Sense: No; SMD: Yes; Status: None; Manufacturer Part Number: ASP-134606-01; ComponentHeight: 5.61mm; Author: LNLS DIG LOS; CreateDate: 30/06/2017; LatestRevisionDate: 30/06/2017
LD1 = LED_OSRAM_LG L29K-G2J1-24-Z: LED Green 1C 2A; Part Description: Surface Mount Green LED (0603 Case); Manufacturer: OSRAM; PressFit: No; Bonding: No; Part Number: LED_OSRAM_LG L29K-G2J1-24-Z; Component Kind: Standard; Component Type: Standard; Color: Green; PackageDescription: Green Chip LED, 2-Leads, Body 1.7x0.8mm, IPC Medium Density; Manufacturer Part Number: LG L29K-G2J1-24-Z; Pin Count: 2; Case: 0603; Mounted: Yes; Socket: No; SMD: Yes; Sense: No; ComponentHeight: 0.67mm; HelpURL: \\cern.ch\dfs\Applications\Altium\Datasheets\LED_OSRAM_LGL29K.pdf; Author: CERN DEM JLC; CreateDate: 24/04/2012; LatestRevisionDate: 24/04/2012
NT1 = Net Tie: Part Description: Net Tie (2 Nets); Mounted: No; Part Number: Net Tie; Component Type: Net Tie; Pin Count: 2; Family: Net Tie; Socket: No; SMD: No; Sense: No; Status: None; ComponentHeight: 0mm; HelpURL: Undefined; Author: CERN DEM JLC; CreateDate: 22/03/2011; LatestRevisionDate: 22/03/2011; PackageDescription: 2 Plated Through Hole For Coaxial Cable Link: Hole Dia.=1.4mm Pad Dia.=2.5mm
R8 = R0402_100R_1%_0.0625W_100PPM: as R1 on sheet Data_IO; Part Number: R0402_100R_1%_0.0625W_100PPM; Component Kind: Standard; Component Type: Standard; Pin Count: 2; Value: 100; Status: Not recommended; Power: 0.0625W; Tolerance: ±1%; Manufacturer Part Number: R0402_100R_1%_0.0625W_100PPM; Case: 0402; Mounted: Yes; Sense: No; Socket: No; SMD: Yes; Manufacturer1 Example: YAGEO PHYCOMP; Manufacturer1 ComponentHeight: 0.4mm; HelpURL: \\cern.ch\dfs\Applications\Altium\Datasheets\R0402_Phycomp_RC0402.pdf; Author: CERN DEM JLC; CreateDate: 03/12/2007; LatestRevisionDate: 17/10/2012
SCREW1-SCREW4 = BOSSARD_BN5687-3061597_v: Screw; Part Description: M2.5 L=6mm Hexalobular Socket Pan Head Screw, Fully Threaded, Stainless Steel A2; Manufacturer Part Number: BN5687 Art.3061597; PressFit: No; Part Number: BOSSARD_BN5687-3061597_v; Component Kind: Standard; Component Type: Mechanical; Pin Count: 0; PackageDescription: M2.5 L=6mm Hexalobular Socket Pan Head Screw, Fully Threaded - Stainless Steel A2; Mounted: Yes; Socket: No; SMD: No; Sense: No; Status: None; Value: M2.5x6; Manufacturer: BOSSARD; ComponentHeight: 2.1mm; HelpURL: \\cern.ch\dfs\Applications\Altium\Datasheets\BOSSARD_BN5687-3061597.pdf; Author: CERN DEM JLC; CreateDate: 30/05/2013; LatestRevisionDate: 30/05/2013

## Nets that join several sheets
GND: Data_IO (27 pins), POF1 (9 pins), POF2 (9 pins), POF3 (9 pins), POF4 (9 pins), POF5 (9 pins), FMC_Conn (70 pins)
P3V3: Data_IO (L1.1 L2.1), FMC_Conn (5 pins)
VADJ: Data_IO (5 pins), FMC_Conn (J2.g39 J2.h1 J2.h40)
VCC_POF: Data_IO (C2.2 L1.2 TP5.1), POF1 (C1_1.2 RR1_1.1 RT1_1.1), POF2 (C1_2.2 RR1_2.1 RT1_2.1), POF3 (C1_3.2 RR1_3.1 RT1_3.1), POF4 (C1_4.2 RR1_4.1 RT1_4.1), POF5 (C1_5.2 RR1_5.1 RT1_5.1)
AFBR_PIN3: Data_IO (IC1.1 IC1.40 R10.2), POF2 (CR1_2.2 J1_2.3 RR1_2.2 RT4_2.2)
AFBR_PIN3: Data_IO (IC1.5 IC1.42 R11.2), POF3 (CR1_3.2 J1_3.3 RR1_3.2 RT4_3.2)
AFBR_PIN3: Data_IO (IC1.8 IC1.19 R12.2), POF4 (CR1_4.2 J1_4.3 RR1_4.2 RT4_4.2)
AFBR_PIN3: Data_IO (IC1.12 IC1.21 R13.2 TP4.1), POF5 (CR1_5.2 J1_5.3 RR1_5.2 RT4_5.2)
AFBR_PIN3: Data_IO (IC2.2 IC2.3 R9.2 TP3.1), POF1 (CR1_1.2 J1_1.3 RR1_1.2 RT4_1.2)
Buffer_POF: Data_IO (IC1.25 IC1.26 TP2.1), POF5 (RR2_5.1 RT2_5.1 RT3_5.2)
Buffer_POF: Data_IO (IC1.28 IC1.29), POF4 (RR2_4.1 RT2_4.1 RT3_4.2)
Buffer_POF: Data_IO (IC1.32 IC1.33), POF3 (RR2_3.1 RT2_3.1 RT3_3.2)
Buffer_POF: Data_IO (IC1.35 IC1.36), POF2 (RR2_2.1 RT2_2.1 RT3_2.2)
Buffer_POF: Data_IO (IC2.1 IC2.4 TP1.1), POF1 (RR2_1.1 RT2_1.1 RT3_1.2)
LA00_CC_N: Data_IO (IC2.7 J4.1 R6.1), FMC_Conn (J2.g7)
LA00_CC_P: Data_IO (IC2.6 J3.1 R6.2), FMC_Conn (J2.g6)
LA01_CC_N: Data_IO (IC1.4 R2.1), FMC_Conn (J2.d9)
LA01_CC_P: Data_IO (IC1.3 R2.2), FMC_Conn (J2.d8)
LA02_N: Data_IO (IC1.10 R3.1), FMC_Conn (J2.h8)
LA02_P: Data_IO (IC1.9 R3.2), FMC_Conn (J2.h7)
LA03_N: Data_IO (IC1.14 J6.1 R4.1), FMC_Conn (J2.g10)
LA03_P: Data_IO (IC1.13 J5.1 R4.2), FMC_Conn (J2.g9)
LA04_N: Data_IO (IC1.48 R1.1), FMC_Conn (J2.h11)
LA04_P: Data_IO (IC1.47 R1.2), FMC_Conn (J2.h10)
LA05_N: Data_IO (D3.2 R11.1), FMC_Conn (J2.d12)
LA05_P: Data_IO (D2.2 R10.1), FMC_Conn (J2.d11)
LA06_N: Data_IO (D5.2 R13.1), FMC_Conn (J2.c11)
LA06_P: Data_IO (D4.2 R12.1), FMC_Conn (J2.c10)
LA07_P: Data_IO (D1.2 R9.1), FMC_Conn (J2.h13)

## Assembly variants
All_Receivers: not fitted CT1_1 CT1_2 CT1_3 CT1_4 CT1_5 J3 J4 J5 J6 RT1_1 RT1_2 RT1_3 RT1_4 RT1_5 RT2_1 RT2_2 RT2_3 RT2_4 RT2_5 RT3_1 RT3_2 RT3_3 RT3_4 RT3_5 RT4_1 RT4_2 RT4_3 RT4_4 RT4_5
Transmitter-1: not fitted CR1_1 CT1_2 CT1_3 CT1_4 CT1_5 J3 J4 J5 J6 RR1_1 RR2_1 RR3_1 RT1_2 RT1_3 RT1_4 RT1_5 RT2_2 RT2_3 RT2_4 RT2_5 RT3_2 RT3_3 RT3_4 RT3_5 RT4_2 RT4_3 RT4_4 RT4_5; alternate parts J1_1 -> AFBR-1624Z
Transmitter-1-2: not fitted CR1_1 CR1_2 CT1_3 CT1_4 CT1_5 J3 J4 J5 J6 RR1_1 RR1_2 RR2_1 RR2_2 RR3_1 RR3_2 RT1_3 RT1_4 RT1_5 RT2_3 RT2_4 RT2_5 RT3_3 RT3_4 RT3_5 RT4_3 RT4_4 RT4_5; alternate parts J1_1 -> AFBR-1624Z, J1_2 -> AFBR-1624Z
Transmitter-1-2-3: not fitted CR1_1 CR1_2 CR1_3 CT1_4 CT1_5 J3 J4 J5 J6 RR1_1 RR1_2 RR1_3 RR2_1 RR2_2 RR2_3 RR3_1 RR3_2 RR3_3 RT1_4 RT1_5 RT2_4 RT2_5 RT3_4 RT3_5 RT4_4 RT4_5; alternate parts J1_1 -> AFBR-1624Z, J1_3 -> AFBR-1624Z, J1_2 -> AFBR-1624Z
Transmitter-1-2-3-4: not fitted CR1_1 CR1_2 CR1_3 CR1_4 CT1_5 J3 J4 J5 J6 RR1_1 RR1_2 RR1_3 RR1_4 RR2_1 RR2_2 RR2_3 RR2_4 RR3_1 RR3_2 RR3_3 RR3_4 RT1_5 RT2_5 RT3_5 RT4_5; alternate parts J1_1 -> AFBR-1624Z, J1_4 -> AFBR-1624Z, J1_3 -> AFBR-1624Z, J1_2 -> AFBR-1624Z
Transmitter-1-2-3-4-5: not fitted CR1_1 CR1_2 CR1_3 CR1_4 CR1_5 J3 J4 J5 J6 RR1_1 RR1_2 RR1_3 RR1_4 RR1_5 RR2_1 RR2_2 RR2_3 RR2_4 RR2_5 RR3_1 RR3_2 RR3_3 RR3_4 RR3_5; alternate parts J1_1 -> AFBR-1624Z, J1_4 -> AFBR-1624Z, J1_3 -> AFBR-1624Z, J1_2 -> AFBR-1624Z, J1_5 -> AFBR-1624Z